# EAGLE board whiskashisei-ver4.1 (EAGLE 9.0.1), part 1 of 2
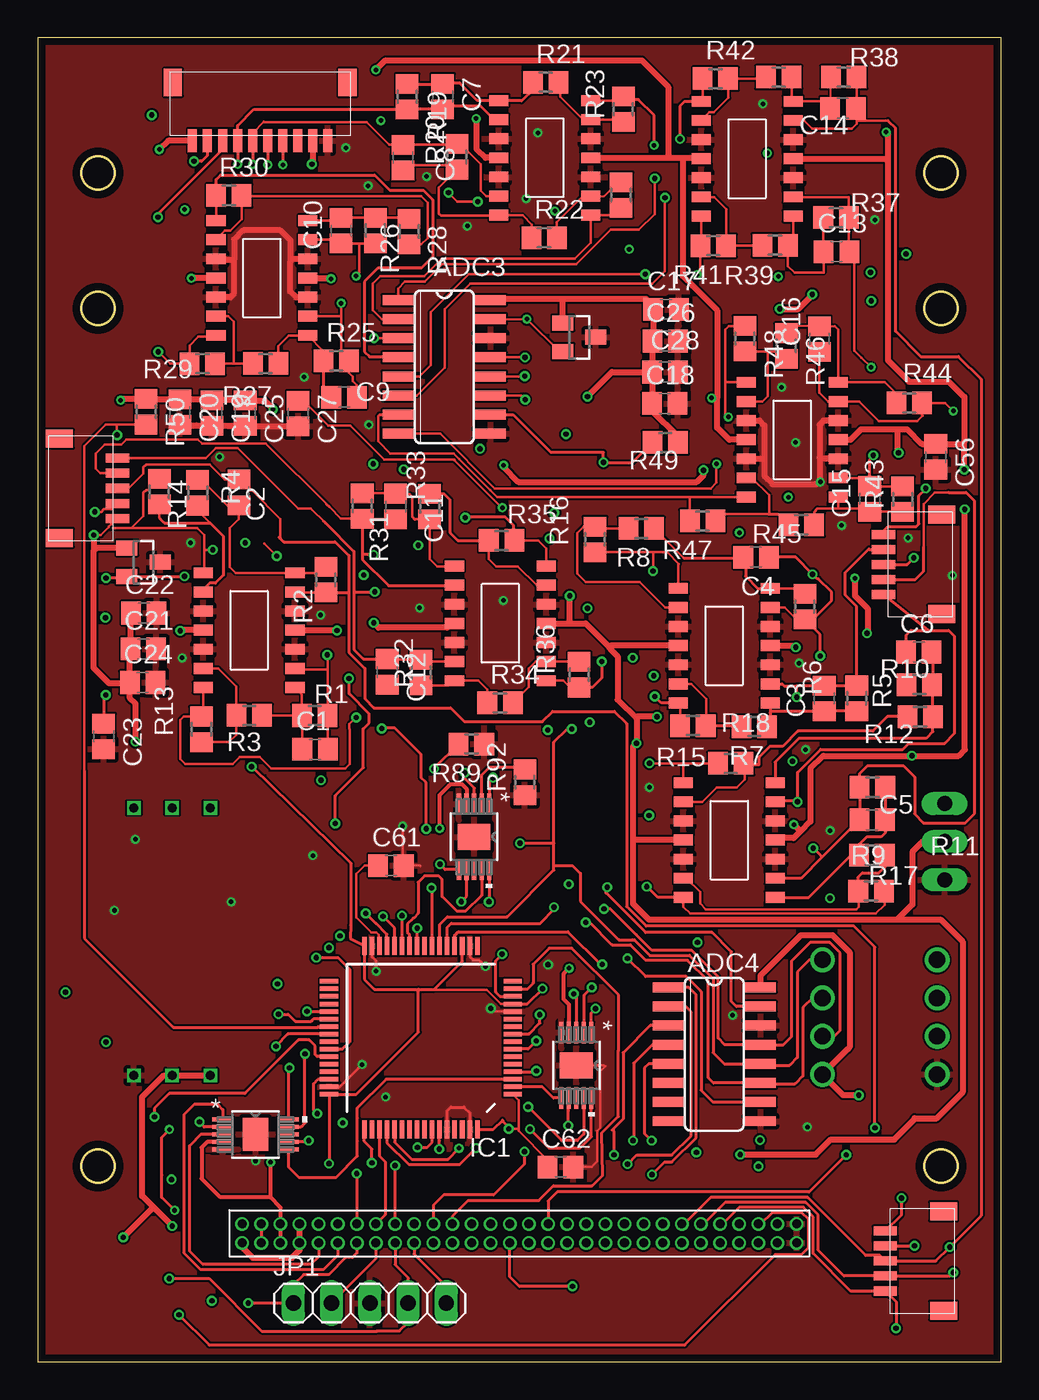
[diagram p5: board, top side]
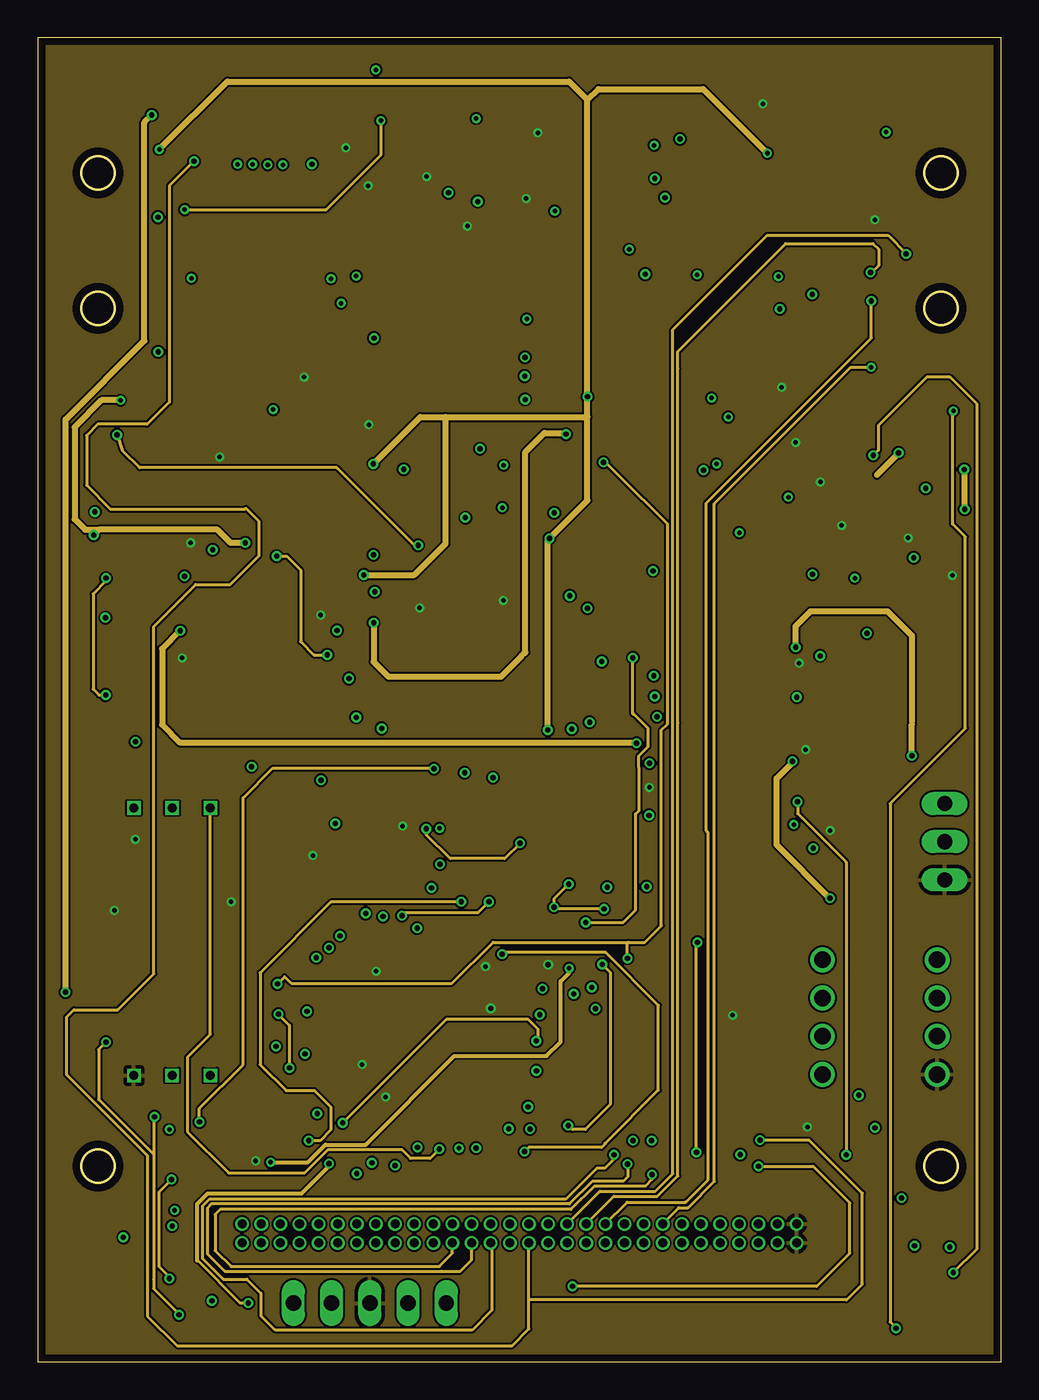
[diagram p6: board, inner layer Route2]
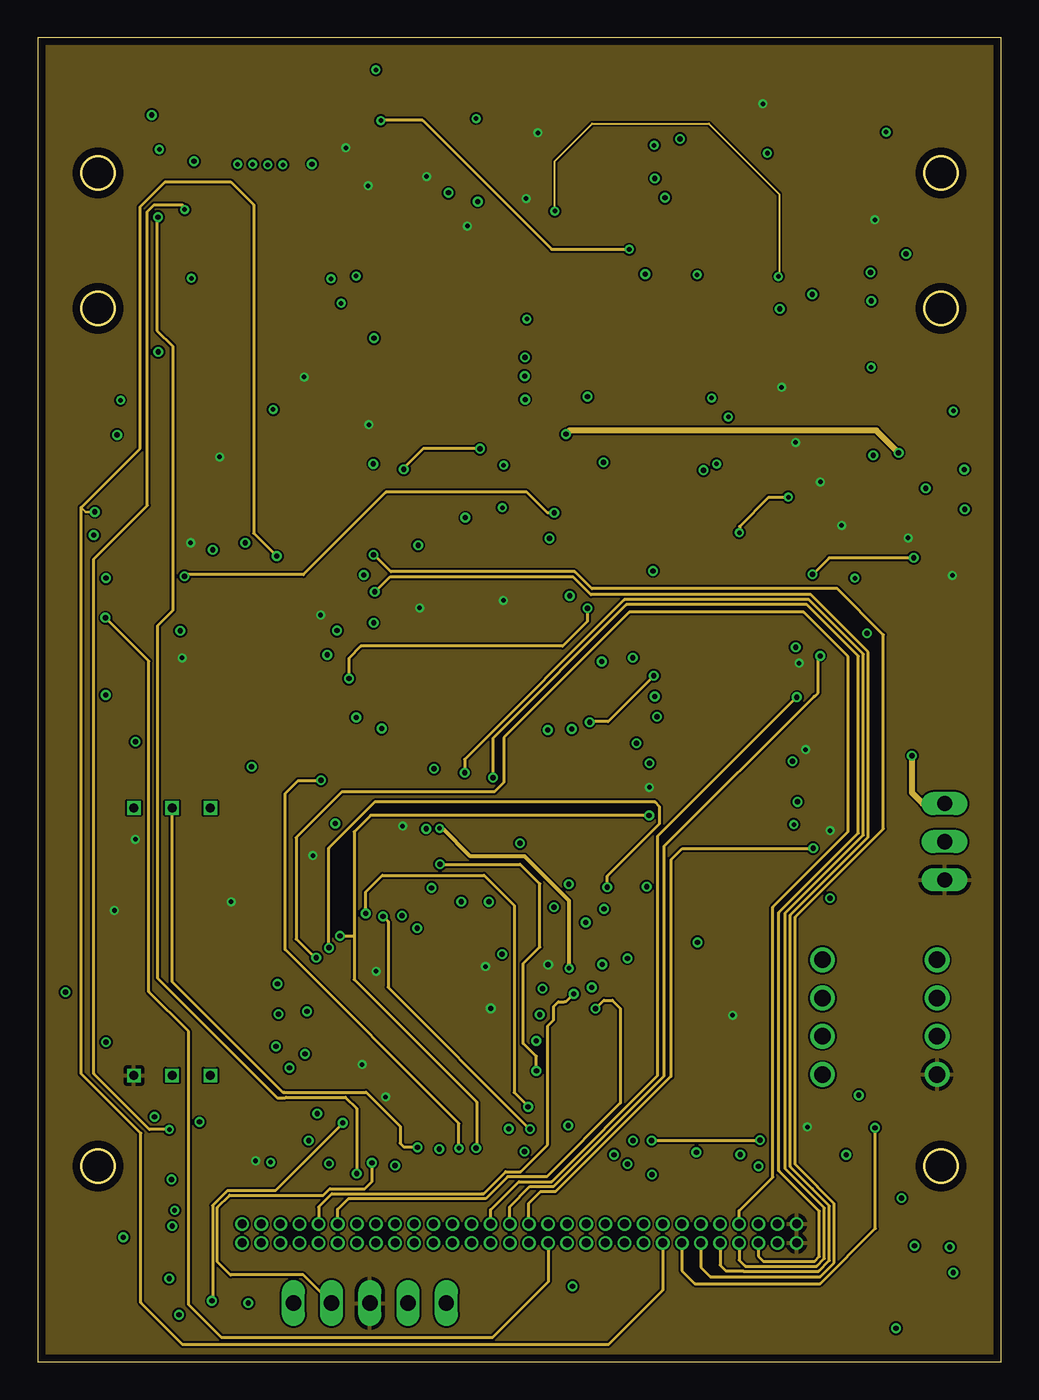
[diagram p7: board, inner layer Route15]
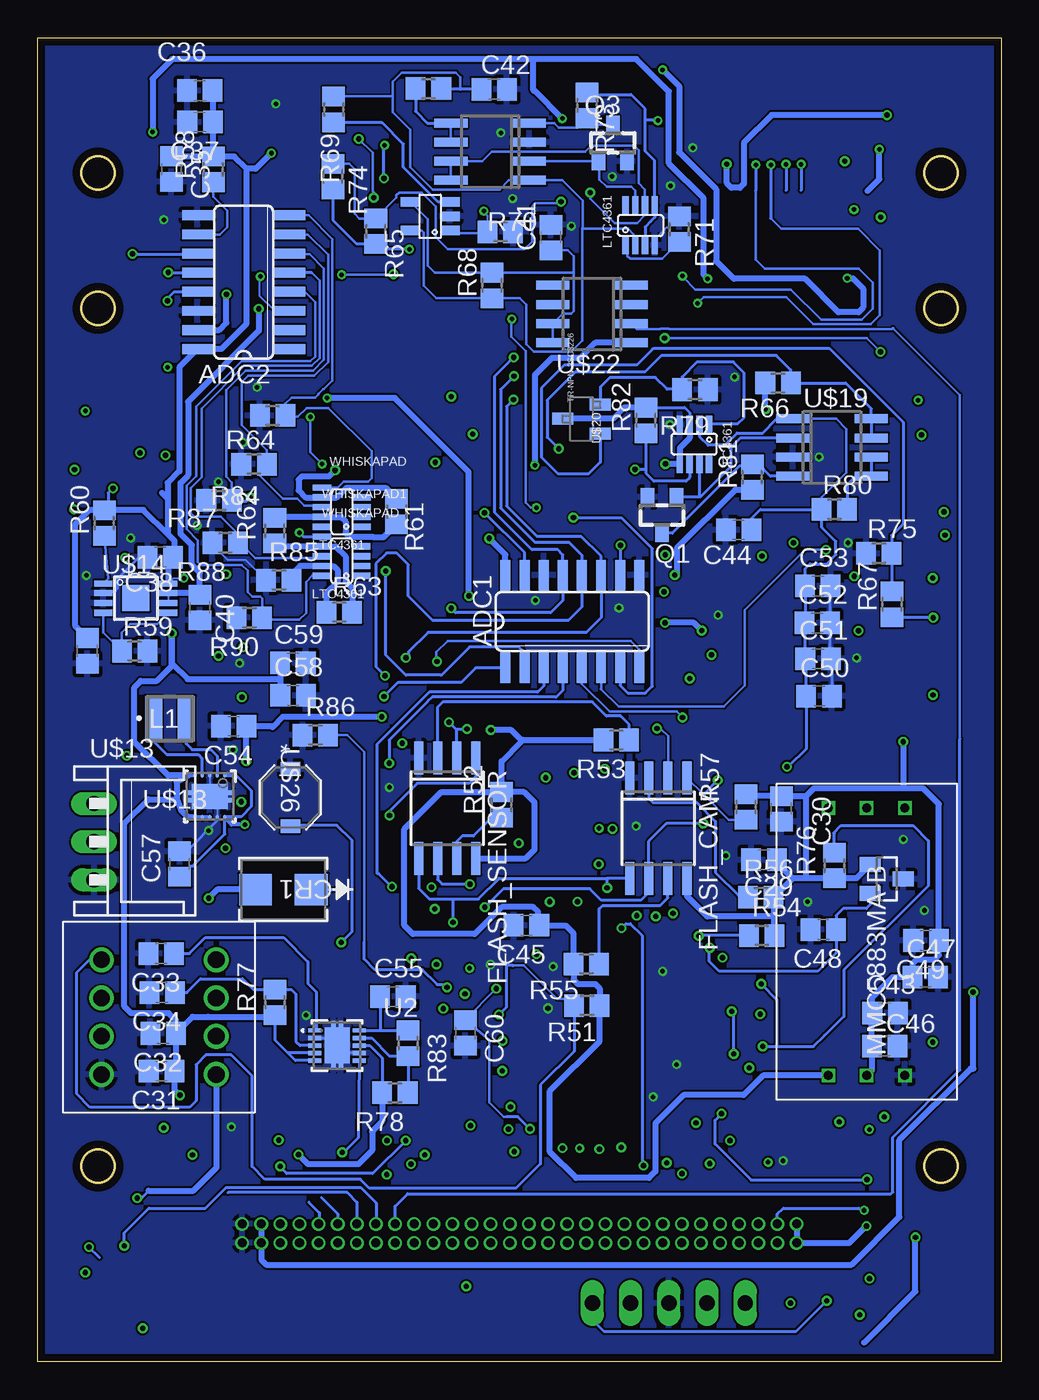
[diagram p8: board, bottom side, seen from below]

Size 64 x 88 mm. Coordinates in mm from the lower left corner, seen from the top.
Outline: 0,0 64,0 64,88 0,88 0,0
Outline: circle at 4,13 radius 1.1
Outline: circle at 60,13 radius 1.1
Outline: circle at 4,70 radius 1.1
Outline: circle at 4,79 radius 1.1
Outline: circle at 60,79 radius 1.1
Outline: circle at 60,70 radius 1.1
Copper layers (1+2*15+16): Top 0.018mm / dielectric 0.25mm / Route2 0.035mm / dielectric 1mm / Route15 0.035mm / dielectric 0.25mm / Bottom 0.018mm
Design rules "pban_5mil-l4": minimum track width 5mil, minimum drill 0.3mm, track to track 5mil, track to pad 0.229mm, pad to pad 5mil, via to via 5mil, smd to smd 5mil, copper to edge 0.5mm, drill to drill 0.5mm, minimum pad ring 0.15mm, minimum via ring 0.15mm, stop-mask expansion 4mil, vias tented up to drill 0.35mm, thermal gap 10mil
tKeepout: area 1.5,76.5 to 6.5,81.5; 4 lines

## Footprints (pad centres in the part's own frame; a part is rotated, then mirrored left to right if it is on the bottom)
SO16 = smd 0.66 x 2.032: 1 -4.445,-3.073; 2 -3.175,-3.073; 3 -1.905,-3.073; 4 -0.635,-3.073; 5 0.635,-3.073; 6 1.905,-3.073; 7 3.175,-3.073; 8 4.445,-3.073; 9 4.445,3.073; 10 3.175,3.073; 11 1.905,3.073; 12 0.635,3.073; 13 -0.635,3.073; 14 -1.905,3.073; 15 -3.175,3.073; 16 -4.445,3.073
C2012 = smd 1.3 x 1.5: 1 -0.85,0; 2 0.85,0
DIODE_DO214AA = smd 2.184 x 2.083: 1 -1.854,0; 2 1.854,0
SO-08M = smd 0.6 x 2.2: 1 -1.905,-3.33; 2 -0.635,-3.33; 3 0.635,-3.33; 4 1.905,-3.33; 5 1.905,3.33; 6 0.635,3.33; 7 -0.635,3.33; 8 -1.905,3.33
LQFP64_PACKAGE = smd 1.2 x 0.3: 1 -6.1,3.75; 2 -6.1,3.25; 3 -6.1,2.75; 4 -6.1,2.25; 5 -6.1,1.75; 6 -6.1,1.25; 7 -6.1,0.75; 8 -6.1,0.25; 9 -6.1,-0.25; 10 -6.1,-0.75; 11 -6.1,-1.25; 12 -6.1,-1.75; 13 -6.1,-2.25; 14 -6.1,-2.75; 15 -6.1,-3.25; 16 -6.1,-3.75; 33 6.1,-3.75; 34 6.1,-3.25; 35 6.1,-2.75; 36 6.1,-2.25; 37 6.1,-1.75; 38 6.1,-1.25; 39 6.1,-0.75; 40 6.1,-0.25; 41 6.1,0.25; 42 6.1,0.75; 43 6.1,1.25; 44 6.1,1.75; 45 6.1,2.25; 46 6.1,2.75; 47 6.1,3.25; 48 6.1,3.75 | smd 0.3 x 1.2: 17 -3.75,-6.1; 18 -3.25,-6.1; 19 -2.75,-6.1; 20 -2.25,-6.1; 21 -1.75,-6.1; 22 -1.25,-6.1; 23 -0.75,-6.1; 24 -0.25,-6.1; 25 0.25,-6.1; 26 0.75,-6.1; 27 1.25,-6.1; 28 1.75,-6.1; 29 2.25,-6.1; 30 2.75,-6.1; 31 3.25,-6.1; 32 3.75,-6.1; 49 3.75,6.1; 50 3.25,6.1; 51 2.75,6.1; 52 2.25,6.1; 53 1.75,6.1; 54 1.25,6.1; 55 0.75,6.1; 56 0.25,6.1; 57 -0.25,6.1; 58 -0.75,6.1; 59 -1.25,6.1; 60 -1.75,6.1; 61 -2.25,6.1; 62 -2.75,6.1; 63 -3.25,6.1; 64 -3.75,6.1
1X05 = drill 1.016 long: 1 -5.08,0; 2 -2.54,0; 3 0,0; 4 2.54,0; 5 5.08,0
LPS3015 = smd 1.14 x 3.05: 1 -1.08,0; 2 1.08,0
SOT23 = smd 0.9 x 1.2: 1 -0.95,-1.2; 2 0.95,-1.2; 3 0,1.2
R2012 = smd 1.3 x 1.5: 1 -0.85,0; 2 0.85,0
DRC0010A = smd 0.36 x 0.24: 1 -1.4,1; 2 -1.4,0.5; 3 -1.4,0; 4 -1.4,-0.5; 5 -1.4,-1; 6 1.4,-1; 7 1.4,-0.5; 8 1.4,0; 9 1.4,0.5; 10 1.4,1 | smd 1.65 x 2.4: 11 0,0 | smd 0.305 x 0.61: P$1 -0.25,1.21; P$2 0.25,1.21; P$3 -0.25,-1.21; P$4 0.25,-1.21 | smd 0.5 x 0.5: V 0,-0.95
DRC10_2P4X1P65 = smd 0.85 x 0.28: 1 -1.475,1; 2 -1.475,0.5; 3 -1.475,0; 4 -1.475,-0.5; 5 -1.475,-1; 6 1.475,-1; 7 1.475,-0.5; 8 1.475,0; 9 1.475,0.5; 10 1.475,1 | smd 1.65 x 2.4: 11 0,0 | smd 0.305 x 0.61: 12 -0.25,1.32; 13 0.25,1.32; 14 -0.25,-1.32; 15 0.25,-1.32
1.27_60 = drill 0.6: P$1 -0.635,18.415; P$2 0.635,18.415; P$3 -0.635,17.145; P$4 0.635,17.145; P$5 -0.635,15.875; P$6 0.635,15.875; P$7 -0.635,14.605; P$8 0.635,14.605; P$9 -0.635,13.335; P$10 0.635,13.335; P$11 -0.635,12.065; P$12 0.635,12.065; P$13 -0.635,10.795; P$14 0.635,10.795; P$15 -0.635,9.525; P$16 0.635,9.525; P$17 -0.635,8.255; P$18 0.635,8.255; P$19 -0.635,6.985; P$20 0.635,6.985; P$21 -0.635,5.715; P$22 0.635,5.715; P$23 -0.635,4.445; P$24 0.635,4.445; P$25 -0.635,3.175; P$26 0.635,3.175; P$27 -0.635,1.905; P$28 0.635,1.905; P$29 -0.635,0.635; P$30 0.635,0.635; P$31 -0.635,-0.635; P$32 0.635,-0.635; P$33 -0.635,-1.905; P$34 0.635,-1.905; P$35 -0.635,-3.175; P$36 0.635,-3.175; P$37 -0.635,-4.445; P$38 0.635,-4.445; P$39 -0.635,-5.715; P$40 0.635,-5.715; P$41 -0.635,-6.985; P$42 0.635,-6.985; P$43 -0.635,-8.255; P$44 0.635,-8.255; P$45 -0.635,-9.525; P$46 0.635,-9.525; P$47 -0.635,-10.795; P$48 0.635,-10.795; P$49 -0.635,-12.065; P$50 0.635,-12.065; P$51 -0.635,-13.335; P$52 0.635,-13.335; P$53 -0.635,-14.605; P$54 0.635,-14.605; P$55 -0.635,-15.875; P$56 0.635,-15.875; P$57 -0.635,-17.145; P$58 0.635,-17.145; P$59 -0.635,-18.415; P$60 0.635,-18.415
MMC5883MA-B = drill 0.6 square: 1 8.89,2.54; 2 8.89,0; 3 8.89,-2.54; 4 -8.89,2.54; 5 -8.89,0; 6 -8.89,-2.54
L3GD20_SET = drill 1.1: CS 10.16,2.54; GND 10.16,10.16; INT1 10.16,7.62; INT2 10.16,5.08; SCL 2.54,7.62; SDI 2.54,5.08; SDO 2.54,2.54; VDD 2.54,10.16
NJM064M = smd 1.27 x 0.72: 1 -3.05,3.81; 2 -3.05,2.54; 3 -3.05,1.27; 4 -3.05,0; 5 -3.05,-1.27; 6 -3.05,-2.54; 7 -3.05,-3.81; 8 3.05,-3.81; 9 3.05,-2.54; 10 3.05,-1.27; 11 3.05,0; 12 3.05,1.27; 13 3.05,2.54; 14 3.05,3.81
JST_3 = drill 1.016 long: 1 2.56,2.56; 2 5.1,2.56; 3 7.64,2.56
ADR3525 = smd 0.4 x 1.2: 1 -1.405,-1.337; 2 -0.755,-1.337; 3 -0.105,-1.337; 4 0.545,-1.337; 5 0.545,2.977; 6 -0.105,2.977; 7 -0.755,2.977; 8 -1.405,2.977 | smd 1.73 x 1.78: TH -0.43,0.82
LTC4361_2 = smd 0.42 x 1.22: P$1 0,0; P$2 0.65,0; P$3 1.3,0; P$4 1.95,0; P$5 1.95,2.62; P$6 1.3,2.62; P$7 0.65,2.62; P$8 0,2.62
SO-08 = smd 0.6 x 2.2: 1 -1.815,-2.74; 2 -0.545,-2.74; 3 0.725,-2.74; 4 1.995,-2.74; 5 1.995,2.46; 6 0.725,2.46; 7 -0.545,2.46; 8 -1.815,2.46
LT6106 = smd 0.635 x 1.27: P$1 0,-0.02; P$2 0.95,-0.02; P$3 1.9,-0.02; P$4 1.9,2.6; P$5 0,2.62
TR-NPN-2SC3326 = smd 0.8 x 1.4: B 0.5,-0.5; C 1.5,2; E 2.4,-0.5
JST_1MM_10 = smd 1.2 x 1.8: P$1 0.6,0.9; P$12 12.2,0.9 | smd 0.6 x 1.55: P$2 1.9,4.775; P$3 2.9,4.775; P$4 3.9,4.775; P$5 4.9,4.775; P$6 5.9,4.775; P$7 6.9,4.775; P$8 7.9,4.775; P$9 8.9,4.775; P$10 9.9,4.775; P$11 10.9,4.775
IND_4012 = smd 0.9 x 1.3: 1 -1.9,0; 2 1.9,0
JST_1MM_5 = smd 1.2 x 1.8: P$1 0.6,0.9; P$7 7.2,0.9 | smd 0.6 x 1.55: P$2 1.9,4.775; P$3 2.9,4.775; P$4 3.9,4.775; P$5 4.9,4.775; P$6 5.9,4.775
SOT23' = smd 1 x 1.4: 1 -0.95,-1.1; 2 0.95,-1.1; 3 0,1.1
LTC4361_2' = smd 0.42 x 1.22: P$1 0,0
DGQ10_2P18X1P72 = smd 1.411 x 0.27: 1 -2.175,1; 2 -2.175,0.5; 3 -2.175,0; 4 -2.175,-0.5; 5 -2.175,-1; 6 2.175,-1; 7 2.175,-0.5; 8 2.175,0; 9 2.175,0.5; 10 2.175,1 | smd 1.72 x 2.18: 11 0,0

## Placement (x,y rotation side)
ADC1  ADC_MCP3208  [SO16]  28.48,49.21 0 bottom
ADC2  ADC_MCP3208  [SO16]  50.32,71.75 90 bottom
ADC3  ADC_MCP3208  [SO16]  27.01,66.12 270 top
ADC4  ADC_MCP3208  [SO16]  44.95,20.44 270 top
C1  1u  [C2012]  18.43,40.7 0 top
C2  1u  [C2012]  13.37,57.78 270 top
C3  1u  [C2012]  52.25,44.09 90 top
C4  1u  [C2012]  47.72,53.47 180 top
C5  1u  [C2012]  55.44,36.02 180 top
C6  1u  [C2012]  58.54,47.17 0 top
C7  1u  [C2012]  26.9,84.08 270 top
C8  1u  [C2012]  24.27,80.03 270 top
C9  1u  [C2012]  20.36,64.11 0 top
C10  1u  [C2012]  20.16,75.17 90 top
C11  1u  [C2012]  23.79,56.85 270 top
C12  1u  [C2012]  23.23,45.86 270 top
C13  1u  [C2012]  53.07,73.77 0 top
C14  1u  [C2012]  53.5,83.31 180 top
C15  1u  [C2012]  55.27,57.35 90 top
C16  1u  [C2012]  51.94,67.97 90 top
C17  0.1u  [C2012]  41.74,69.94 0 top
C18  1u  [C2012]  41.66,63.69 0 top
C19  0.1u  [C2012]  11.57,63.05 270 top
C20  1u  [C2012]  9.45,63.11 270 top
C21  0.1u  [C2012]  7.02,47.38 0 top
C22  1u  [C2012]  7.05,49.76 0 top
C23  0.1u  [C2012]  4.39,41.56 270 top
C24  10u  [C2012]  6.98,45.14 0 top
C25  0.1u  [C2012]  13.79,63.04 270 top
C26  1u  [C2012]  41.68,67.83 0 top
C27  0.1u  [C2012]  17.3,63.02 270 top
C28  10u  [C2012]  41.67,65.77 0 top
C29  0.1u  [C2012]  15.75,33.37 180 bottom
C30  0.1u  [C2012]  14.6,36.75 270 bottom
C31  0.1u  [C2012]  55.77,19.32 180 bottom
C32  10u  [C2012]  55.66,21.83 180 bottom
C33  4700p  [C2012]  55.79,27.14 180 bottom
C34  10u  [C2012]  55.73,24.55 180 bottom
C35  [C2012]  55.11,79.27 270 bottom
C36  [C2012]  53.22,84.48 180 bottom
C37  [C2012]  53.21,82.39 180 bottom
C38  0.1u  [C2012]  55.85,53.47 180 bottom
C39  1u  [C2012]  60.7,47.25 270 bottom
C40  0.1u  [C2012]  53.22,50.13 270 bottom
C41  0.1u  [C2012]  29.9,74.71 90 bottom
C42  1u  [C2012]  33.68,84.57 0 bottom
C43  0.1u  [C2012]  7.71,23.18 0 bottom
C44  1u  [C2012]  17.44,55.29 180 bottom
C45  1u  [C2012]  31.53,29.01 180 bottom
C46  0.1u  [C2012]  7.73,20.99 0 bottom
C47  1u  [C2012]  5.03,25.57 0 bottom
C48  0.1u  [C2012]  11.81,28.73 180 bottom
C49  10u  [C2012]  4.99,28.01 180 bottom
C50  0.1u  [C2012]  12.1,44.24 0 bottom
C51  0.1u  [C2012]  12.16,46.73 0 bottom
C52  0.1u  [C2012]  12.22,49.11 0 bottom
C53  0.1u  [C2012]  12.17,51.56 0 bottom
C54  22u  [C2012]  50.97,42.24 180 bottom
C55  0.22u  [C2012]  40.4,24.27 0 bottom
C56  0.1u  [C2012]  59.66,60.15 270 top
C57  10u  [C2012]  54.58,33.09 90 bottom
C58  0.1u  [C2012]  47.03,44.29 0 bottom
C59  10u  [C2012]  47.04,46.45 0 bottom
C60  0.1u  [C2012]  35.58,21.86 270 bottom
C61  2.2u  [C2012]  23.47,32.98 0 top
C62  1u  [C2012]  34.73,12.95 0 top
CR1  SL23-E3/52T  [DIODE_DO214AA]  47.67,31.39 180 bottom
FLASH_CAM  MP25P80  [SO-08M]  22.77,35.47 180 bottom
FLASH_SENSOR  MP25P80  [SO-08M]  36.79,36.79 180 bottom
IC1  STM32F446_LQFP64  [LQFP64_PACKAGE]  25.46,21.54 180 top
JP1  [1X05]  22.07,3.9 0 top
L1  LPS3015-222MRB  [LPS3015]  55.21,42.74 0 bottom
Q1  BSS138  [SOT23]  22.52,56.28 180 bottom
Q3  BSS138  [SOT23]  25.79,81 0 bottom
R1  [R2012]  18.41,42.95 0 top
R2  [R2012]  19.14,51.98 270 top
R3  1k  [R2012]  14.05,42.96 180 top
R4  1k  [R2012]  10.63,57.76 270 top
R5  [R2012]  54.41,44.09 90 top
R6  [R2012]  50.97,50.2 270 top
R7  1k  [R2012]  47.61,42.22 180 top
R8  1k  [R2012]  40.1,55.39 180 top
R9  [R2012]  55.45,38.18 180 top
R10  [R2012]  58.57,45.01 180 top
R11  1k  [R2012]  55.42,33.67 0 top
R12  1k  [R2012]  58.62,42.87 180 top
R13  [R2012]  10.88,42.04 90 top
R14  [R2012]  8.08,57.83 270 top
R15  [R2012]  43.53,42.28 180 top
R16  [R2012]  37.02,54.66 90 top
R17  [R2012]  55.36,31.29 0 top
R18  [R2012]  46.04,39.77 0 top
R19  [R2012]  24.54,84.07 270 top
R20  [R2012]  27.85,80.07 90 top
R21  1k  [R2012]  33.76,85.03 0 top
R22  1k  [R2012]  33.64,74.7 0 top
R23  [R2012]  38.91,83.25 90 top
R24  [R2012]  38.75,77.54 90 top
R25  [R2012]  19.83,66.52 0 top
R26  [R2012]  22.44,75.18 270 top
R27  1k  [R2012]  15.14,66.35 180 top
R28  1k  [R2012]  24.68,75.11 270 top
R29  [R2012]  10.95,66.33 180 top
R30  [R2012]  12.71,77.51 0 top
R31  [R2012]  21.56,56.88 270 top
R32  [R2012]  25.47,45.81 90 top
R33  1k  [R2012]  26.04,56.84 90 top
R34  1k  [R2012]  30.72,43.8 0 top
R35  [R2012]  30.82,54.58 0 top
R36  [R2012]  35.97,45.66 90 top
R37  [R2012]  53.04,76.05 0 top
R38  [R2012]  53.55,85.38 0 top
R39  1k  [R2012]  48.99,74.2 180 top
R40  1k  [R2012]  49.23,85.38 180 top
R41  [R2012]  44.88,74.17 180 top
R42  [R2012]  45.02,85.28 0 top
R43  [R2012]  57.47,57.33 90 top
R44  [R2012]  57.9,63.72 0 top
R45  1k  [R2012]  50.73,55.63 180 top
R46  1k  [R2012]  49.74,67.51 270 top
R47  [R2012]  44.17,55.88 180 top
R48  [R2012]  46.98,67.99 270 top
R49  [R2012]  41.69,61.1 180 top
R50  [R2012]  7.2,63.14 270 top
R51  10k  [R2012]  27.52,23.68 180 bottom
R52  10k  [R2012]  33.18,37.02 90 bottom
R53  10k  [R2012]  25.56,41.33 180 bottom
R54  10k  [R2012]  15.9,28.33 0 bottom
R55  10k  [R2012]  27.55,26.44 180 bottom
R56  10k  [R2012]  15.96,30.87 0 bottom
R57  10k  [R2012]  16.94,36.88 90 bottom
R58  [R2012]  52.33,79.24 90 bottom
R59  10k  [R2012]  57.56,47.24 0 bottom
R60  10k  [R2012]  59.57,55.75 90 bottom
R61  [R2012]  40.16,56.51 270 bottom
R62  [R2012]  48.25,55.23 90 bottom
R63  [R2012]  43.97,49.82 0 bottom
R64  [R2012]  48.39,62.89 180 bottom
R65  0.10  [R2012]  41.54,75.13 270 bottom
R66  0.10  [R2012]  14.81,65.05 180 bottom
R67  1k  [R2012]  7.24,50.34 90 bottom
R68  0.1  [R2012]  33.82,71.53 90 bottom
R69  10  [R2012]  44.34,83.23 270 bottom
R70  22k  [R2012]  33.26,75.1 0 bottom
R71  10k  [R2012]  21.37,75.28 270 bottom
R72  10  [R2012]  38.04,84.61 180 bottom
R73  10k  [R2012]  27.5,83.5 270 bottom
R74  0.62  [R2012]  44.39,78.76 270 bottom
R75  10k  [R2012]  8.12,53.73 0 bottom
R76  [R2012]  11.07,32.98 90 bottom
R77  1k  [R2012]  48.23,23.89 90 bottom
R78  410k  [R2012]  40.27,17.89 180 bottom
R79  10k  [R2012]  20.33,64.61 180 bottom
R80  10  [R2012]  11.07,56.66 0 bottom
R81  10k  [R2012]  16.52,58.8 90 bottom
R82  0.62  [R2012]  23.6,62.56 90 bottom
R83  150k  [R2012]  39.39,21.18 270 bottom
R84  [R2012]  49.62,59.65 180 bottom
R85  1Ω  [R2012]  47.98,51.94 0 bottom
R86  0  [R2012]  45.55,41.65 0 bottom
R87  [R2012]  51.95,57.25 180 bottom
R88  [R2012]  51.53,54.43 180 bottom
R89  0  [R2012]  28.82,41.06 180 top
R90  [R2012]  49.93,49.45 180 bottom
R92  0  [R2012]  32.37,38.52 90 top
U1  Value  [DRC0010A]  52.56,37.58 270 bottom
U2  TPS63700DRCRG4  [DRC10_2P4X1P65]  44.11,21.02 0 bottom
U$1  1.27_60  [1.27_60]  32,8.54 90 top
U$3  [MMC5883MA-B]  8.93,27.92 270 bottom
U$4  L3GD20_SET  [L3GD20_SET]  49.59,29.26 180 bottom
U$5  NJM064M  [NJM064M]  14.05,48.62 180 top
U$6  NJM064M  [NJM064M]  45.61,47.6 180 top
U$7  NJM064M  [NJM064M]  45.95,34.68 180 top
U$8  NJM064M  [NJM064M]  33.69,80.01 0 top
U$9  NJM064M  [NJM064M]  14.9,72.03 180 top
U$10  NJM064M  [NJM064M]  30.74,49.07 0 top
U$11  NJM064M  [NJM064M]  47.13,79.95 180 top
U$12  NJM064M  [NJM064M]  50.13,61.28 180 top
U$13  JST_3  [JST_3]  62.81,39.67 270 bottom
U$14  ADR3525  [ADR3525]  58.29,50.33 270 bottom
U$15  LTC4361  [LTC4361_2]  24.95,74.22 0 bottom
U$16  IRF7910  [SO-08]  34.08,80.33 90 bottom
U$17  LTC4361  [LTC4361_2]  19.39,62.29 180 bottom
U$18  LT6106  [LT6106]  36.63,75.18 90 bottom
U$19  IRF7910  [SO-08]  11.09,60.86 270 bottom
U$20  TR-NPN-2SC3326  [TR-NPN-2SC3326]  27.12,61.2 90 bottom
U$21  JST_1MM_10  [JST_1MM_10]  21.18,85.92 180 top
U$22  IRF7910  [SO-08]  27.32,69.54 90 bottom
U$23  LTC4361  [LTC4361_2]  42.49,55.5 90 bottom
U$26  VLF4012  [IND_4012]  47.21,37.51 270 bottom
U$27  LTC4361  [LTC4361_2]  42.5,52.24 90 bottom
U$31  JST_1MM_5  [JST_1MM_5]  60.96,49.09 90 top
U$32  JST_1MM_5  [JST_1MM_5]  0.53,61.95 270 top
U$34  JST_1MM_5  [JST_1MM_5]  61.09,2.81 90 top
V_REF1  LM50  [SOT23']  7.03,53.14 270 top
V_REF2  LM50  [SOT23']  35.99,68.08 270 top
V_REF3  LM50  [SOT23']  7.59,32.09 270 bottom
WHISKAPAD1  WHISKAPAD  [LTC4361_2']  45.11,54.84 270 bottom
WHISKAPAD2  WHISKAPAD  [LTC4361_2']  45.11,58.1 270 bottom
X_DRV  DRV8832_DGQ_10  [DGQ10_2P18X1P72]  35.79,19.71 270 top
X_DRV1  DRV8832_DGQ_10  [DGQ10_2P18X1P72]  14.47,15.11 0 top
X_DRV2  DRV8832_DGQ_10  [DGQ10_2P18X1P72]  28.99,34.89 270 top

## Tracks (layer width: path | path; a pad name or v marks a point on that pad's centre or on a via)
2.5REF  (via drill 0.35)
  Top 0.406: v51.45,70.94 51.45,70.89 50.54,69.97 v49.3,69.97
  Bottom 0.127: U$14.7 U$14.6
  Bottom 0.406: U$14.7 53.31,51.08 C40.1 53.22,52.44 53.75,52.98 53.75,54.27 54.51,55.02 54.51,58.4 54.01,58.9 54.01,63.81 49.3,68.51 v49.3,69.97 | v51.45,70.94 51.45,69.06 51.94,68.57 ADC2.15
3V3_TOLUCA  (via drill 0.3)
  Top 0.254: U$1.P$5 U$1.P$6 16.12,10.27 15.47,10.92 | X_DRV1.4 11.25,14.61 10.89,14.25 10.89,12.18 12.09,10.98 15.41,10.98 15.47,10.92 | 15.47,10.92 v15.47,13.27 | v35.31,26.16 34.93,25.78 34.93,24.11 35.29,23.75 X_DRV.4 | v26.7,35.45 26.7,37.66 27.43,38.39 28.18,38.39 28.49,38.08 X_DRV2.4
  Route2 0.254: v15.47,13.27 17.96,13.27 19.12,14.43 21.79,14.43 27.68,20.32 33.79,20.32 34.75,21.28 34.75,25.3 35.31,25.86 v35.31,26.16
  Route15 0.254: v35.31,26.16 35.31,30.64 32.35,33.6 28.75,33.6 26.9,35.45 v26.7,35.45
3V3_WHISKA  (via drill 0.3)
  Top 0.203: U$1.P$4 U$1.P$3 | v9.1,10.07 8.24,10.93 8.24,12.39 8.26,12.41 8.26,14.93 8.75,15.42 v8.75,15.44
  Route2 0.203: v9.77,76.57 19.17,76.57 22.81,80.21 22.81,82.46 v22.8,82.47 v22.8,82.48
  Route15 0.127: v22.8,82.48 22.82,82.5
  Route15 0.203: v8.75,15.44 7.43,15.44 3.73,19.14 3.73,53.35 7.29,56.91 7.29,76.45 7.74,76.89 9.57,76.89 9.56,76.89 9.77,76.68 v9.77,76.57 | v39.3,73.93 34.15,73.93 25.58,82.5 22.82,82.5
  Bottom 0.127: 41.19,73.93 R65.2
  Bottom 0.203: U$15.P$5 23,76.06 23.27,75.8 23.65,75.41 U$15.P$3 | 23.01,76.85 23.01,79.83 23.64,80.45 23.64,82.5 | 27.37,84.21 24.57,84.21 23.64,83.27 23.64,82.5 | R65.2 42.79,74.28 44.39,75.87 R74.2 | U$1.P$4 14.86,9.82 14.46,10.22 9.45,10.22 9.3,10.07 v9.1,10.07 | v22.8,82.48 22.82,82.5 23.64,82.5 | v39.3,73.93 41.19,73.93
  Bottom 0.406: U$15.P$3 | U$15.P$5 23.01,76.85 | R73.1 27.37,84.21
+3V3  (via drill 0.3, 0.35)
  Top 0.152: v3.73,54.94 4.2,54.94 4.73,55.47 4.73,55.51 4.89,55.68 4.93,55.68 U$32.P$6
  Top 0.2: ADC4.16 48.02,25.08 | v59,58.05 59,58.01 58.54,57.55 58.54,55.69 58.35,55.5 56.49,55.5 56.19,55.2 U$31.P$6 | U$34.P$6 57.39,9.79 v57.39,10.88 | 53.94,20.9 53.83,20.79
  Top 0.406: 34.99,70.65 30.28,70.65 30.2,70.57 ADC3.16 | 34.99,70.65 40.41,70.65 40.89,70.16 C17.1 40.89,67.89 C26.1 40.83,65.78 C28.1 | V_REF2.1 34.89,70.55 34.99,70.65 | v5.51,63.9 5.59,63.99 R50.1 9.43,63.99 C20.1 11.52,63.96 C19.1 13.63,63.91 13.64,63.89 C25.1 15.08,63.89 15.65,63.32 v15.65,63.29 | v55.09,48.42 55.14,48.47 55.14,50.07 54.29,50.92 v54.29,52.09 | U$21.P$11 8.66,81.14 v8.09,80.57 | 13.81,54.44 13.81,54.42 v13.79,54.42 | v3.73,54.94 3.73,53.91 | U$3.3 U$3.2 8.38,19.03 6.95,17.6 6.95,11.02 7.67,10.3 | 53.94,20.9 53.94,27.22 52.81,28.35 50.7,28.35 48.02,25.67 48.02,25.08 | 53.83,20.79 U$4.VDD 53.51,17.72 v54.55,17.72 | v8.94,9.03 7.67,10.3 | v5.69,8.28 7.67,10.26 7.67,10.3 | v6.5,41.21 6.5,43.74 6.13,44.11 6.13,45.11 | 6.13,45.11 C24.1 6.13,47.33 C21.1 6.17,49.73 C22.1 | 3.73,53.91 3.71,53.88 3.71,46.14 4.74,45.11 6.13,45.11 | C28.1 40.83,63.7 C18.1 40.81,63.22 42.54,61.49 R49.1 | v36.52,64.14 38.15,65.77 C28.1 | V_REF1.1 3.91,54.09 3.73,53.91 | U$1.P$8 U$1.P$7 17.39,7.41 16.89,6.9 14.3,6.9 13.59,7.62 U$1.P$1
  Route2 0.406: v13.79,54.42 12.82,54.42 11.94,55.3 4.06,55.3 | 4.06,55.3 3.73,54.97 v3.73,54.94 | 4.06,55.3 3.15,55.3 2.45,56 2.45,62.12 4.23,63.9 v5.51,63.9 | 36.52,62.8 36.52,57.24 v34,54.72 33.89,54.61 v33.89,41.99 | 36.52,62.8 v36.52,64.14 36.52,83.84 | v22.3,59.67 25.43,62.8 27.11,62.8 | 27.11,62.8 36.52,62.8 | v21.67,52.29 25.03,52.29 27.11,54.37 27.11,62.8 | 36.52,83.84 36.52,83.87 35.31,85.08 12.6,85.08 v8.09,80.57 | 36.52,83.84 37.26,84.58 44.21,84.58 v48.47,80.32 v48.48,80.32
  Bottom 0.127: U$14.8 54.96,52.09 v54.29,52.09
  Bottom 0.2: 20.86,30.95 FLASH_CAM.8 | U$17.P$3 20.69,63.09 21.02,63.41 R82.2 | v22.3,59.67 | R77.1 48.23,22.58 | 48.14,23.13 R77.1 | 54.81,37.38 54.76,37.39 | 47.38,20.52 46.88,20.02 U2.5 | R77.1 48.23,21.37 47.38,20.52 | U2.4 47.38,20.52 | 54.86,53.47 C38.1 | v59,58.05 59.31,57.74 59.31,56.85 59.56,56.61 R60.2 | v57.39,10.88 57.12,10.88 56.63,11.38
  Bottom 0.203: U1.7 U1.8
  Bottom 0.254: U1.8 U1.6 | U1.5 54.02,38.96
  Bottom 0.406: ADC1.16 32.92,53.65 v34,54.72 | U$14.8 55.32,53.16 C38.1 54.92,53.55 54.92,54.56 55.37,55.02 | C39.1 61.53,48.93 61.53,55.63 60.57,56.6 R60.2 | C36.1 52.37,82.4 C37.1 52.36,80.12 R58.2 | R58.2 55.08,80.09 C35.1 | R58.2 50.92,80.09 50.11,79.28 | 50.11,79.28 50.11,69 51.79,67.33 52.16,67.33 52.19,67.3 ADC2.16 54.59,66.1 54.59,59.18 55.37,58.4 55.37,57.38 | v8.09,80.57 8.09,78.6 8.87,77.82 | 8.58,23.16 C46.1 8.58,19.38 U$3.2 | 8.58,23.16 C43.1 | U$1.P$2 U$1.P$1 10.09,7.9 8.96,9.03 v8.94,9.03 | R57.2 16.82,37.6 C30.1 13.01,37.6 12.98,37.57 | 12.98,32.13 R76.1 9.61,32.13 V_REF3.1 | 12.98,37.57 12.98,32.13 | 8.58,23.16 8.58,24.19 7.2,25.57 C47.1 5.88,26.49 5.62,26.75 4.42,26.75 4.14,27.04 C49.1 4.14,37.07 5.18,38.12 6.56,38.12 | 15.11,29.61 R56.2 13.85,32.13 | 15.11,29.61 15.11,28.39 R54.2 | 20.86,30.95 19.51,29.59 15.13,29.59 15.11,29.61 | R51.1 26.66,24.82 26.95,25.11 28.11,25.11 28.4,25.39 R55.2 28.4,28.47 28.92,29 30.66,29 C45.1 30.76,29.09 30.76,29.93 31.06,30.23 33.17,30.23 34.97,28.43 39.08,28.43 39.64,28.99 39.64,35.41 37.17,37.87 R52.2 | R51.1 | R53.2 31.77,41.33 31.88,41.21 | R52.2 33.18,39.91 31.88,41.21 | U$3.3 15.8,19.03 17.1,17.73 21.09,17.73 22.96,15.86 22.96,12.65 23.39,12.23 28.24,12.23 29.96,13.96 29.96,18 26.66,21.3 R51.1 | 12.98,37.57 12.43,38.12 6.56,38.12 | v6.5,41.21 6.5,38.17 6.56,38.12 | v5.69,8.28 5.69,4.68 9.09,1.28 | FLASH_SENSOR.8 31.58,33.46 30.99,34.05 30.99,37.18 31.68,37.87 R52.2 | U$20.C 25.74,62.7 25.02,63.41 R82.2 | 55.37,57.38 55.37,55.02 | 55.37,55.02 55.37,55.01 56.97,56.61 59.56,56.61 | U$17.P$3 20.69,61.38 21.34,60.73 U$17.P$5 v22.3,59.67
  Bottom 0.406: 31.88,41.21 31.88,41.34 32.53,41.99 v33.89,41.99 | R81.1 17.67,57.95 21.54,54.07 21.54,52.41 v21.66,52.29 v21.67,52.29 | 56.63,11.38 53.65,11.38 52.13,12.9 U$4.VDD | v15.65,63.29 15.66,63.29 R66.2 | 12.98,32.13 13.85,32.13 | 13.85,32.13 14.9,33.18 C29.1 | v48.48,80.32 49.52,79.28 50.11,79.28 | C59.1 47.89,45.37 | 47.89,45.37 C58.1 | C32.1 54.81,19.43 C31.1 54.92,18.09 v54.55,17.72 | C32.1 53.7,22.94 52.68,22.94 52.65,22.92 48.35,22.92 48.14,23.13 | C32.1 54.81,22.69 55.28,23.17 57.79,23.17 58.23,23.61 58.23,35.77 56.62,37.38 54.81,37.38 | U1.6 53.99,36.16 54.47,36.65 54.76,37.39 54.76,38.53 54.02,38.96 55.33,38.96 57.58,41.21 57.58,44.83 57.16,45.25 56.08,45.25 55.09,46.24 v55.09,48.42 55.09,46.42 54.04,45.37 47.89,45.37 | 55.73,57.74 55.37,57.38
+X_IN  (via drill 0.35)
  Top 0.2: v40.81,12.45 41.64,13.28 42.13,13.28 43.75,14.89 43.75,24.39 43.25,24.89 ADC4.1
  Route2 0.2: U$1.P$23 27.55,7.22 26.68,6.35 12.85,6.35 11.8,7.39 11.8,9.8 12.12,10.12 35.42,10.12 36.98,11.68 40.37,11.68 40.81,12.12 v40.81,12.45
+X_X1  (via drill 0.35)
  Top 0.127: 50.48,37.29 v50.48,37.22
  Top 0.2: U$1.P$34 33.91,10.69 34.51,11.29 51.25,11.29 v53.71,13.76 | R10.2 57.72,47.14 C6.1 57.69,48.29 58.01,48.62 59.1,48.62 | U$7.6 49.07,37.29 50.48,37.29 | 59.1,48.62 60.51,48.62 60.9,48.23 60.9,41.77 60.24,41.11 57.87,41.11 57.47,40.71 52.02,40.71 50.48,39.17 v50.48,37.22 | 59.1,48.62 59.14,48.65 U$31.P$2
  Route2 0.2: v50.48,37.22 50.48,36.44 53.71,33.21 v53.71,13.76
+X_X2  (via drill 0.35)
  Top 0.15: R6.2 51.04,49.28 51.03,49.28 50.49,49.28 49.63,50.14 U$6.6
  Top 0.152: U$31.P$4 55.79,52.99 55.62,52.82
  Top 0.2: U$31.P$4 57.76,52.99 v58.2,53.43 | C4.1 50.34,53.47 v51.48,52.34 51.79,52.02 51.86,52.02 52.74,51.14 52.74,50.6 51.49,49.35 R6.2 | v51.98,46.91 51.98,48.33 51.03,49.28
  Route15 0.2: U$1.P$30 31.36,10.31 32.7,11.65 34.28,11.65 41.6,18.97 41.6,34.24 51.58,44.22 51.62,44.22 51.85,44.45 51.85,46.91 v51.98,46.91 | v58.2,53.43 52.58,53.43 v51.48,52.34
+X_Y1  (via drill 0.35)
  Top 0.152: 60.51,57.77 59.61,57.77 58.86,57.02 58.86,54.16
  Top 0.2: 52.05,33.48 C5.2 54.6,36.03 R9.2 54.6,39.1 55.13,39.62 57.5,39.62 58.25,38.87 58.25,36.41 58.84,35.82 61.62,35.82 62.25,36.45 62.25,57.2 61.68,57.77 60.51,57.77 | 52.05,33.48 50.71,32.14 U$7.2 | v51.52,34.14 52.05,33.61 52.05,33.48 | U$31.P$3 58.31,51.99 58.86,52.54 58.86,54.16
  Route15 0.2: v51.52,34.14 51.52,34.1 42.82,34.1 42.06,33.34 42.06,18.97 34.41,11.32 33.42,11.32 32.63,10.54 U$1.P$32
+X_Y2  (via drill 0.35)
  Top 0.2: U$6.2 49.46,45.06 49.59,44.93 50.41,44.93 | 50.41,44.93 50.53,44.93 50.54,44.94 C3.2 54.4,44.94 R5.2 54.41,50.19 53.66,50.94 53.66,52.47 55.22,54.02 55.25,53.99 U$31.P$5 | v50.43,44.17 50.43,44.91 50.41,44.93
  Route15 0.2: U$1.P$28 30.09,10.11 31.96,11.98 34.14,11.98 41.19,19.03 41.19,34.93 v50.43,44.17
+Z_IN  (via drill 0.35)
  Top 0.2: U$21.P$10 11.28,80.16 10.9,79.77 v10.38,79.77 v10.38,79.78 | v40.79,14.71 40.31,15.18 40.31,19.52 40.6,19.81 ADC4.5
  Route2 0.2: 32.63,4.12 32.63,2.19 31.52,1.07 9.26,1.07 7.3,3.03 7.3,13.71 1.91,19.1 1.91,22.9 2.4,23.39 5.32,23.39 7.72,25.8 7.72,48.88 10.5,51.66 12.8,51.66 14.68,53.54 14.68,55.88 13.84,56.72 13.79,56.68 4.82,56.68 3.25,58.25 3.25,61.56 3.98,62.3 7.28,62.3 8.76,63.78 8.76,78.15 v10.38,79.78 | 32.63,4.12 U$1.P$31 | 32.63,4.12 53.75,4.12 54.78,5.16 54.78,11.21 51.25,14.73 v47.99,14.73
  Route15 0.2: v40.79,14.71 47.96,14.71 v47.99,14.73
+Z_X1  (via drill 0.3)
  Top 0.15: v21.16,72.15 21.38,72.37 21.38,74.32
  Top 0.152: U$9.6 19.92,74.57 C10.1 21.38,74.32 R26.2
  Top 0.2: U$21.P$5 16.28,79.56 v16.29,79.55
  Bottom 0.15: 16.3,77.81 16.3,73.25 15.69,72.64 9.47,72.64 8.54,71.71 8.54,69.98 9.25,69.27 11.96,69.27 13.96,71.27 20.32,71.27 21.16,72.11 v21.16,72.15
  Bottom 0.2: v16.29,79.55 16.29,77.83 16.3,77.82 16.3,77.81
+Z_X2  (via drill 0.3)
  Top 0.15: R20.2 27.8,80.88 C8.1 23.37,80.88 21.86,82.39 15.04,82.39 15.03,82.4
  Top 0.152: U$21.P$7 14.31,81.12 14.31,81.68 15.03,82.4 | U$8.6 29.79,77.47 29.42,77.84 29.42,79.59 28.13,80.88 27.88,80.88
  Top 0.2: U$21.P$7 v14.28,79.59 v14.29,79.58 | 27.88,80.88 R20.2
  Bottom 0.2: v14.29,79.58 14.29,77.84
+Z_Y1  (via drill 0.3)
  Top 0.15: v20.15,70.35 20.15,69.53 | 20.15,69.53 20.15,66.26 20.68,65.73 20.94,65.47 | U$9.2 20.11,69.49 20.15,69.53
  Top 0.152: R25.2 20.68,65.73 | 20.94,65.47 20.94,65.18 21.21,64.92 C9.2
  Top 0.2: U$21.P$6 v15.28,79.55 v15.29,79.55
  Bottom 0.15: 15.31,75.99 14.61,75.29 9.5,75.29 8.05,73.84 8.05,69.58 8.67,68.95 12.46,68.95 14.26,70.75 19.75,70.75 v20.15,70.35
  Bottom 0.2: 15.31,75.99 15.29,76.01 v15.29,79.55
+Z_Y2  (via drill 0.3)
  Top 0.2: v13.28,79.58 U$21.P$8 13.28,82.15 14.37,83.23 24.56,83.23 | 24.56,83.23 C7.2 27.1,83.43 29.44,83.43 30.32,82.55 U$8.2 | 24.56,83.23 R19.2
  Bottom 0.2: v13.28,79.58 13.28,77.85
-X_IN  (via drill 0.35)
  Top 0.2: ADC4.2 41.9,23.64 43.01,23.64 43.41,23.25 43.41,15.03 42.14,13.76 39.81,13.76 v39.19,13.14
  Route2 0.2: U$1.P$25 28.82,6.77 28.08,6.03 26.83,6.03 26.82,6.02 12.43,6.02 11.27,7.18 11.27,10.22 11.55,10.49 35.33,10.49 36.84,12.01 38.9,12.01 39.19,12.29 v39.19,13.14
-X_X1  (via drill 0.35)
  Top 0.15: U$10.6 25.6,46.53 R32.2 23.41,46.66 23.36,46.71 23.31,46.71 C12.1
  Top 0.152: 19.13,55.74 18.15,56.72 17.31,56.72 13.29,60.73 11.84,60.73 11.15,60.05 U$32.P$2
  Top 0.2: 23.31,46.71 21.64,46.71 21.01,47.34 21.01,51.16 21.01,53.86 19.13,55.74 19,55.87
  Top 0.203: 21.01,51.16 22.38,51.16 v22.39,51.17
  Route15 0.2: U$1.P$51 45.34,6.42 45.72,6.04 46.86,6.04 46.87,6.03 51.88,6.03 52.59,6.73 52.59,10.37 51.48,11.47 51.48,11.5 51.46,11.5 50,12.96 50,29.7 55.17,34.87 55.17,47.17 51.37,50.98 36.75,50.98 35.54,52.19 23.43,52.19 22.41,51.16 v22.4,51.16 v22.39,51.17
-X_X2  (via drill 0.35)
  Top 0.15: U$5.6 17.13,51.13 R2.2
  Top 0.152: 16.12,54.72 16.12,56.02 14.25,57.89 14.12,57.89 C2.1 12.44,58.63 11.44,59.63 7.21,59.63 7.03,59.45 7.03,59.04 6,58.01 5.35,58.01 U$32.P$4
  Top 0.2: 16.05,54.8 16.12,54.72 16.36,54.48 19.72,54.48 19.75,54.51 20.67,53.59 20.67,51.12 | 20.67,51.12 20.67,47.14 21.73,46.08 21.73,44.07 22.33,43.47 27.44,43.47 28.35,42.55 28.35,42.54 33.52,42.54 34.21,43.23 38.31,43.23 39.13,42.42 39.13,30.26 40.43,28.96 54.23,28.96 55.62,27.56 v55.62,15.56 | R2.2 20.66,51.13 20.67,51.12
  Route15 0.2: U$1.P$47 42.8,6.06 43.66,5.2 51.98,5.2 55.65,8.87 55.65,15.53 v55.62,15.56
-X_Y1  (via drill 0.35)
  Top 0.15: C11.2 21.59,56 R31.2 20.15,56.03 19.39,56.79 19.18,57
  Top 0.152: U$32.P$3 4.16,59.05 3.86,59.35 3.86,60.35 4.47,60.97 5.54,60.97 5.88,61.3 10.65,61.3 10.93,61.02 13.3,61.02 13.41,61.02 15.16,61.02 19.39,56.79
  Top 0.2: R31.2 21.56,53.65 | 21.56,53.65 21.56,53.33 23.31,51.58 27.66,51.58 U$10.2 | v22.31,53.63 22.29,53.65 21.56,53.65
  Route15 0.2: U$1.P$49 44.06,6.3 44.69,5.67 51.98,5.67 52.91,6.6 52.91,10.51 51.81,11.61 51.81,11.64 50.33,13.12 50.33,29.56 56.19,35.42 56.19,48.31 53.12,51.38 36.81,51.38 35.68,52.51 23.46,52.51 22.32,53.65 v22.31,53.63
-X_Y2  (via drill 0.35)
  Top 0.15: C1.2 19.26,40.72 R1.2 19.26,46.02 | 19.26,46.02 19.26,46.96 v19.24,46.98 | 15.05,54.38 v15.88,53.54 | U$5.2 17.16,46.02 19.26,46.02
  Top 0.152: U$32.P$5 4.91,56.66 4.41,56.66 4.23,56.48 v3.8,56.48
  Route2 0.2: v15.88,53.54 16.55,53.54 17.47,52.62 17.47,47.86 18.35,46.98 v19.24,46.98
  Route15 0.152: v3.8,56.48 3.2,56.48 2.89,56.78
  Route15 0.2: v15.88,53.54 14.36,55.07 14.36,76.89 12.82,78.42 8.47,78.42 6.81,76.76 6.81,60.7 2.89,56.78 2.89,19.16 6.85,15.2 6.85,3.94 9.64,1.15 37.91,1.15 41.52,4.76 U$1.P$45
-Y_IN  (via drill 0.35)
  Top 0.152: v38.28,13.76 38.28,15.53
  Top 0.2: ADC4.3 40.7,22.35 38.9,20.55 38.9,16.15 38.28,15.53 38.17,15.42 38.28,15.31 v38.28,13.76
  Route2 0.2: U$1.P$27 30.16,7.83 30.16,3.41 28.86,2.11 15.79,2.11 14.83,3.07 14.83,4.56 13.9,5.49 12.34,5.49 10.95,6.88 10.95,10.35 11.42,10.83 35.11,10.83 37.16,12.88 37.7,12.88 38.28,13.46 v38.28,13.76
-Y_X1  (via drill 0.3, 0.35)
  Top 0.15: v60.83,63.19 60.3,63.72 R44.2 58.75,62.93 58.78,62.9 58.42,62.53 55.87,62.53 54.58,63.82 U$12.6 52.51,63.82 51.94,64.39 C16.1
  Top 0.2: U$1.P$52 45.5,9.17 46.61,10.28 50.87,10.28 51.52,9.63 51.52,7.2 54.01,4.71 U$34.P$2 57.02,4 v57.02,2.24
  Route2 0.2: v60.83,63.19 60.9,63.12 60.79,63 60.79,55.66 61.62,54.83 61.62,42.09 56.64,37.11 56.64,2.65 57.04,2.25 v57.02,2.24
  Bottom 0.2: U$1.P$52 45.29,9.22 45.29,9.92 45.97,10.61
-Y_X2  (via drill 0.35)
  Top 0.152: R38.2 54.4,83.36 | 54.4,83.36 C14.1 | U$11.6 50.92,82.49 51.46,81.96 54.09,81.96 54.4,82.27 54.4,82.48 | 54.4,82.48 54.4,83.36 | 54.4,82.48 54.41,82.49 56.49,82.49
  Top 0.2: 56.49,82.49 56.99,81.99 56.99,68.48 58.66,66.82 61.16,66.82 62.68,65.3 62.68,9.71 v60.59,7.62 59.68,6.71 U$34.P$4 55.94,7.08 55,7.08 51.14,10.93 44.72,10.93 42.96,9.17 U$1.P$48
  Bottom 0.2: U$1.P$48 42.8,10.61 43.45,11.26 51.35,11.26 | 59.91,6.94 v60.59,7.62
-Y_Y1  (via drill 0.35)
  Top 0.15: U$12.2 54.73,58.74 C15.2 | 55.38,58.18 R43.2
  Top 0.2: 55.38,58.18 55.3,58.18 C15.2 55.27,59.95 55.51,60.18 v55.51,60.23 | U$1.P$50 44.23,9.17 45.67,10.6 51.01,10.6 51.85,9.76 51.85,7.42 53.56,5.71 U$34.P$3 60.6,5.71 v60.83,5.94
  Route2 0.2: v55.51,60.23 55.86,60.58 55.86,62.23 59.05,65.43 60.61,65.43 62.41,63.63 62.41,7.51 v60.83,5.94
  Bottom 0.2: U$1.P$50 44.06,9.84 45.15,10.93
-Y_Y2  (via drill 0.3, 0.35)
  Top 0.15: U$11.2 53.89,77.41 R37.2 53.89,73.8 C13.2 54.26,74.11 54.26,67.2 54.71,66.75 54.71,66.74 v55.36,66.09
  Top 0.2: U$34.P$5 v58.25,7.71
  Route2 0.2: v55.36,66.09 54.01,66.09 44.96,57.03 44.96,11.99 43.22,10.25 42.59,10.25 41.52,9.19 U$1.P$46
  Bottom 0.2: U$1.P$46 41.52,10.56 42.55,11.59 51.48,11.59 52.85,10.22 56.6,10.22 58.25,8.57 v58.25,7.71
-Z_IN  (via drill 0.35)
  Top 0.2: v35.53,5.02 32,5.02 31.35,5.67 31.35,7.89 U$1.P$29 | v39.55,14.7 39.59,14.7 39.59,19.84 40.83,21.08 ADC4.4
  Route2 0.2: v35.53,5.02 51.74,5.02 53.95,7.23 53.95,10.56 51.51,13 v47.89,13
  Bottom 0.2: v47.89,13 47.89,12.95 47.45,12.52 41.74,12.52 v39.55,14.7
ADC1_CS  (via drill 0.35)
  Top 0.15: 3.1,60.85 3.1,39.27 | v5.28,61.59 5.26,62.25 5.29,62.29
  Top 0.152: R50.2 5.29,62.29 4.54,62.29 3.1,60.85
  Top 0.2: IC1.39 19.34,22.27 18.62,22.27 18.6,22.24 9.01,22.24 3.1,28.16 3.1,39.27
  Route2 0.2: v5.28,61.59 5.63,60.57 6.78,59.42 19.87,59.42 25.04,54.26 v25.28,54.26
  Bottom 0.2: ADC1.10 25.28,52.31 v25.28,54.26
ADC2_CS  (via drill 0.35)
  Top 0.2: v15.84,20.96 15.82,20.98 16.63,21.79 IC1.40 | ADC4.10 44.86,17.27 44.08,18.05 44.08,24.61 43.09,25.6 40.39,25.6 39.18,26.8 v39.18,26.82 | ADC3.10 31.58,62.95 34.09,60.44 37.58,60.44 37.58,59.78 v37.59,59.77 39.51,59.77 R49.2
  Route2 0.152: 38.61,58.89 38.56,58.94
  Route2 0.2: v15.94,25.12 v15.95,25.12 16.41,25.59 16.85,25.15 27.51,25.15 30.25,27.89 39.24,27.89 | 38.56,58.94 37.73,59.77 v37.59,59.77 | 39.24,27.89 40.34,27.89 41.44,28.98 41.44,41.99 41.84,42.4 41.84,55.66 38.61,58.89 | v39.18,26.82 39.18,27.83 39.24,27.89
  Bottom 0.2: R76.2 11.07,35.09 11.13,35.15 10.63,35.64 5.85,35.64 4.84,34.63 4.84,31.64 10.45,26.03 10.45,22.95 11.7,21.7 11.72,21.7 12.46,20.96 14.89,20.96 | v15.84,20.96 14.89,20.96 | v15.94,25.12 14.89,24.07 14.89,20.96
CRT-18F  (via drill 0.3)
  Route15 0.127: v34.36,76.47 34.36,79.8 36.84,82.28 44.59,82.28 49.26,77.61 49.26,72.13 v49.21,72.13
  Bottom 0.127: R70.1 34.11,76.09 34.35,76.49 v34.36,76.47 | v49.21,72.13 49.27,72.07 49.27,70.86 48.25,69.84 ADC2.3
  Bottom 0.152: U$18.P$1 36.45,75.02 34.53,75.02 34.45,75.1 R70.1
CS_GYRO  (via drill 0.35)
  Top 0.2: IC1.9 31.58,21.81 32.64,21.81 33.35,22.52 v33.35,23.07 v33.36,23.07
  Bottom 0.152: R51.2 28.81,24.13 29.49,24.13 31.7,26.34 32.44,26.34
  Bottom 0.2: 32.4,26.34 32.44,26.34 32.87,26.34 32.87,23.56 v33.36,23.07 | R51.2 28.37,20.64 30.61,18.4 30.61,13.16 32.23,11.54 41.96,11.54 42.57,12.14 48.9,12.14 49.75,12.99 49.75,19 51.14,20.39 52.83,20.39 53.48,19.75 53.48,17.35 53.9,16.93 60.53,16.93 61.4,17.79 61.4,25.89 60.51,26.78 59.81,26.78 U$4.CS
FAULT_X
  Top 0.2: X_DRV.6 34.27,17.53 33.51,18.29 IC1.2
FAULT_Y
  Top 0.2: X_DRV1.6 16.65,12.96 17.33,12.28 19.84,12.28 21.24,13.68 21.24,14.69 21.23,14.7 21.23,16.17 21.24,16.19 21.24,16.88 23.15,18.79 IC1.3
FAULT_Z  (via drill 0.35)
  Top 0.2: IC1.4 33.06,19.29 v33.12,19.35 v33.13,19.34 | X_DRV2.6 27.07,32.72 v26.72,33.06 v26.72,33.07
  Route15 0.2: v26.72,33.07 32.05,33.07 33.35,31.76 33.35,27.57 32.26,26.48 32.26,21.15 32.29,21.15 33.13,20.31 v33.13,19.34
FLASH1_CS  (via drill 0.35)
  Top 0.2: IC1.52 23.21,14.57 24.67,13.11 28.03,13.11 v29.13,14.21
  Route15 0.2: v29.13,14.21 29.16,14.24 29.16,17.26 21.02,25.4 21.02,28.32 | v40.62,36.32 22.11,36.32 21.02,35.22 21.02,28.32 | v20.09,28.31 21.01,28.31 21.02,28.32
  Bottom 0.2: v40.62,36.32 40.65,36.32 40.65,36.59 38.79,38.45 35.33,38.45 34.88,38.89 FLASH_SENSOR.1 | R54.1 20.05,28.33 20.06,28.34 v20.09,28.31
FLASH2_CS  (via drill 0.3, 0.35)
  Top 0.2: IC1.53 23.71,14.6 24.84,13.46
  Top 0.203: 24.84,13.46 27.26,13.46 v27.99,14.19 v27.99,14.2
  Route15 0.2: v18.82,38.65 18.82,38.63 17.31,38.63 16.45,37.76 16.45,27.39 27.99,15.85 v27.99,14.2
  Bottom 0.152: FLASH_CAM.1 19.77,37.7 18.09,36.03 R57.1
  Bottom 0.2: v18.82,38.65 19.77,37.71 19.77,37.7
GND  (via drill 0.3, 0.35)
  Top 0.15: U$7.12 43.05,33.41
  Top 0.152: 18,70.76 U$9.3 | 30.05,68.06 ADC3.14 | C61.2 24.48,32.98 | 24.48,32.98 25.38,32.98 25.4,32.96 | v24.25,35.6 24.25,33.21 24.48,32.98 | C62.2 36.81,12.95 37.19,13.32 37.19,15.36 37.37,15.54 37.37,19.31 37.69,19.63 37.61,19.71 X_DRV.11 | IC1.12 30.3,23.29 v30.1,23.49
  Top 0.2: IC1.31 22.23,27.66 | v29.75,26.27 29.31,26.71 28.92,26.71 28.71,26.92 IC1.18 | IC1.60 27.21,16.68 27.45,16.92 28.32,16.92 28.71,16.53 IC1.63 | IC1.47 20.08,18.29 v21.55,19.76
  Top 0.203: v22.48,25.95 22.48,26.65 22.23,26.9 22.23,27.66 IC1.31
  Top 0.254: U$9.3 17.73,70.76
  Top 0.406: U$12.10 47.95,62.55 48.28,62.23 48.28,59.9 | 48.28,59.9 48.28,58.88 48.83,58.33 51.74,58.33 51.94,58.53 51.94,60.12 | U$12.5 52.22,62.55 51.94,62.28 51.94,60.12 | 30.02,61.74 ADC3.9 30.1,61.67 | 12.8,70.74 13.05,71 13.05,73.25 | 12.78,70.76 U$9.12 | 18,70.76 17.98,70.74 17.17,70.74 16.76,71.15 16.76,73.1 16.78,73.11 | C20.2 9.51,62.2 C19.2 13.78,62.2 C25.2 17.29,62.19 C27.2 | 37.06,68.11 V_REF2.3 | 16.78,73.11 16.78,74.53 16.12,75.2 13.67,75.2 13.05,74.58 13.05,73.25 | U$9.10 11.89,73.25 13.05,73.25 | 16.78,73.11 16.96,73.3 U$9.5 | U$12.12 48.16,60.01 48.28,59.9 | U$12.3 52.05,60.01 51.94,60.12 | U$11.3 50.13,78.63 | 50.1,81.14 U$11.5 50.03,81.07 | U$8.3 30.7,81.22 | U$5.5 | 30.19,68.12 ADC3.14 | X_DRV.11 35.37,20.12 35.37,20.16
  Bottom 0.127: R71.1 22.13,75.37 22.24,75.37 23,74.61 U$15.P$4 | U1.3 U1.11 52.07,37.56 U1.9 | R85.1 50.18,53.3 51.37,53.3 52.38,54.32 R88.2
  Bottom 0.152: 35.42,21.12 C60.2
  Bottom 0.2: C50.2 11.24,46 11.37,46.13 C52.2 11.37,51.51 C53.2 11.32,51.67 | U1.9 52.07,36.16 52.07,35.97 54.1,33.94 C57.2 | C38.2 57.24,53.47 58.7,52.01 58.7,51.39 58.89,51.2 59.51,51.2 U$14.2
  Bottom 0.203: U2.7 43.61,20.52 U2.11 44.61,21.52 U2.2
  other vias: 51.14,15.62 25.38,50.1 30.94,50.6 52.64,35.31 51.01,40.69 20.48,80.68 21.96,78.16 25.84,78.77 32.45,77.31 50.58,46.44 33.23,81.68 49.42,64.76 12.09,60.13 55.62,75.89 5.1,30 6.49,34.73 12.85,30.58 18.29,33.64 28.54,75.48 50.35,61.1 14.48,13.36 33.91,26.39 17.7,65.45 22,62.27 9.6,46.78 10.16,54.43 51.99,58.48 46.17,23.04 53.41,55.58 48.18,83.6 57.83,54.76 60.76,52.26 18.8,49.63 40.63,38.18 23.12,17.61
  pour Top: 0,88 64,88 64,0 0,0
  pour Bottom: 9,88 64,88 64,0 0,0 0,88
  pour Route2: 0,88 64,88 64,0 0,0
  pour Route15: 0,88 64,88 64,0 0,0
GND_SOLAR  (via drill 0.35)
  Top 0.406: U$21.P$3 18.28,79.66 v18.22,79.6
  Route2 0.406: v1.86,24.57 1.86,62.62 7.09,67.85 7.09,82.37 7.57,82.85 v7.58,82.85
  Bottom 0.406: U$1.P$58 U$1.P$57 49.15,6.79 48.82,6.47 9.92,6.47 6.76,9.63 6.76,14.75 2.03,19.48 1.86,19.48 1.85,19.5 1.85,24.57 v1.86,24.57 | v7.58,82.85 15.25,82.85 17.09,81.02 17.09,78.28 17.35,78.02 17.91,78.02 18.22,78.33 18.22,79.56 18.2,79.58 v18.22,79.6
I2C1_SCL  (via drill 0.35)
  Top 0.2: IC1.58 26.21,14.59 25.86,14.25 v25.23,14.25
  Route15 0.2: U$3.5 8.93,25.27 16.32,17.88 16.36,17.92 21.82,17.92 24.08,15.66 24.08,14.53 24.35,14.26 v25.23,14.26 v25.23,14.25
I2C1_SDA  (via drill 0.35)
  Top 0.2: IC1.59 26.72,15.43 26.69,15.39 26.69,14.7 26.68,14.7 v26.68,14.14
  Route2 0.2: U$3.6 11.47,21.78 9.94,20.25 9.94,15.29 12.68,12.55 17.74,12.55 19.26,14.08 24.22,14.08 24.77,13.53 26.07,13.53 v26.68,14.14
MD_VOL_DEF  (via drill 0.35)
  Top 0.2: v18,14.7 17.91,14.61 X_DRV1.7 | v28.14,30.59 28.49,30.94 X_DRV2.7
  Route2 0.2: v28.14,30.59 28.1,30.55 19.48,30.55 14.79,25.85 14.79,19.75 16.51,18.03 18.39,18.03 19.47,16.95 19.47,15.41 18.76,14.7 v18,14.7
MD_VOL_REF  (via drill 0.35)
  Top 0.2: v37.51,26.42 37.39,26.42 35.22,28.59 27.95,28.59 27.93,28.57 27.92,28.57 27.71,28.35 IC1.20 | v35.24,15.71 35.24,16.68 35.25,16.69 35.25,17.5 X_DRV.7
  Route2 0.2: v37.51,26.42 38.03,25.89 38.03,17.1 36.38,15.45 35.54,15.45 35.29,15.71 v35.24,15.71
N$1
  Top 0.15: R8.1 42.91,53.42 | 48.73,51.48 U$6.7 48.74,51.41 50.61,51.41 R6.1
  Top 0.2: C4.2 46.92,53.42 | 48.74,51.41 47.83,51.41 47.03,52.21 47.03,53.31 46.92,53.42 | 42.91,53.42 46.92,53.42
N$2  (via drill 0.35)
  Top 0.15: R15.2 42.68,43.66 U$6.14
  Top 0.2: U$6.14 41.44,43.79 41.01,44.22 v41,44.22 v40.99,44.21
  Bottom 0.2: ADC1.1 34.9,46.13 34.9,46.1 35.84,45.16 40.04,45.16 v40.99,44.21
N$3  (via drill 0.35)
  Top 0.15: R16.1 40.86,53.8 | 40.85,53.81 41.81,53.81 42.6,53.03 42.56,52.98 U$6.8
  Top 0.152: v40.88,52.56 40.88,53.78 40.86,53.8 40.85,53.81
  Bottom 0.2: ADC1.2 31.66,47.13 32.03,47.51 34.62,47.51 35.3,47.51 37.2,45.62 37.21,45.63 39.53,45.63 40.88,46.98 v40.88,52.56
N$4  (via drill 0.35)
  Top 0.15: 5.01,55.4 6.22,55.4 10.61,55.4 11.05,54.95 11.05,53.94 | 11.05,53.94 11.05,52.49 11.02,52.45 | 11.05,53.94 11.61,53.94 v11.63,53.97
  Top 0.152: 6.22,55.4 7.03,56.2 7.03,57.75 7.21,57.93 7.34,57.93 R14.1
  Top 0.2: U$5.8 11.02,52.45
  Bottom 0.15: v11.63,53.97 13.01,53.97 17.02,49.96 17.02,44.94 18.41,43.54 25.4,43.54 26.58,44.73 26.57,44.73 26.57,45.86
  Bottom 0.406: ADC1.6 26.57,45.86
N$5
  Top 0.15: R8.2 37.14,55.39 R16.2 36.28,55.51 35.85,55.07 35.85,52.39 36.4,51.84 40.01,51.84 41.71,50.14 U$6.9
N$6  (via drill 0.35)
  Top 0.15: R35.2 33.25,54.58 33.79,54.04 U$10.14
  Top 0.2: R35.2 31.62,54.63 31.62,55.58 31.06,56.14 28.52,56.14 28.48,56.1 v28.41,56.1
  Bottom 0.2: ADC1.7 25.3,44.95 24.8,44.45 23.63,44.45 23.17,44.91 23.17,54.04 25.23,56.1 v28.41,56.1
N$7  (via drill 0.35)
  Top 0.15: R36.1 35.38,44.81 34.93,45.27 33.8,45.27 U$10.8
  Top 0.2: v37.47,46.54 37.47,45.44 36.85,44.81 R36.1
  Bottom 0.15: v37.47,46.54 37.51,46.57 37.51,47.16 36.76,47.9 24.6,47.9 24.04,47.34 ADC1.8
N$8  (via drill 0.35)
  Top 0.127: R13.2 11,43
  Top 0.15: 11,43 U$5.14 | R13.2 9.7,42.89 9.48,42.66 9.48,40.05 9.81,39.72 12.95,39.72 13.41,40.18 14.75,40.18 15.51,39.43
  Top 0.152: 15.51,39.43 20.43,39.43 20.73,39.73 20.73,42.04 20.71,42.06 20.71,42.38 v21.16,42.83
  Bottom 0.152: ADC1.5 27.84,45.05 26.01,43.22 21.56,43.22 v21.16,42.83
N$9  (via drill 0.3, 0.35)
  Top 0.127: R23.2 38.63,83.82
  Top 0.15: 38.63,83.82 U$8.14 | 24.39,71.77 25.71,71.77 26.88,72.94 35.79,72.94 38.08,75.24 39.94,75.24 40.98,76.28 40.98,78.62 v41,78.64
  Top 0.152: ADC3.1 23.94,71.33 24.39,71.77
  Top 0.2: v40.95,80.84 40.95,82.84 39.91,83.88 38.69,83.88 38.63,83.82
  Bottom 0.2: v40.95,80.84 41,80.89 v41,78.64
N$10
  Top 0.15: R2.1 18.75,52.44 U$5.7 13.16,52.44 12.77,52.82 12.77,55.42
  Top 0.152: C2.2 13.37,56.82 | 13.37,56.82 13.37,56.02 12.77,55.42 | R4.1 10.91,58.6 12.77,56.75 13.3,56.75 13.37,56.82
N$11
  Top 0.152: 8.12,56.05 8.08,56.09 R14.2 | R4.2 10.63,56.58 11.46,55.75
  Top 0.2: 8.12,56.05 8.42,55.75 11.46,55.75 12.34,54.87 12.34,52.29 11.8,51.75 11.43,51.75 11,51.31 U$5.9
N$12
  Top 0.15: R20.1 27.54,79.53 24.62,79.53 C8.2
  Top 0.152: R22.1 32.83,74.73 32.83,75.58 32.21,76.2 U$8.7 30.61,76.16 26.81,76.16 26.66,76.31 26.66,78.04 R20.1
N$13
  Top 0.15: R3.1 R1.1 | U$5.1 17.56,44.35 R1.1 | R1.1 17.58,42.94 C1.1
N$14
  Top 0.15: U$5.13 12,46.09 13.21,44.88 R3.2 13.19,42.95 13.19,41.67 12.71,41.19 R13.1
N$15
  Bottom 0.2: C33.1 53.93,27.14 52.86,28.2 47.66,28.2 46.04,26.59 46.04,25.15 46.05,25.14 45.51,24.59 45.51,22.1 U2.1
N$16
  Top 0.2: R5.1 54.41,43.2 54.35,43.26 52.27,43.26 C3.1 48.75,43.23 48.66,43.14 | U$6.1 48.66,43.14 | 48.66,43.14 48.66,42.42 R7.1
N$17
  Top 0.15: U$6.13 43.41,45.06 44.41,44.06 44.41,42.3 R15.1
  Top 0.2: R15.1 46.7,42.28 R7.2
N$21
  Top 0.15: 59.47,44.95 R10.1
  Top 0.2: C6.2 59.47,47.09 59.47,44.95 R12.1 59.47,41.88 59.02,41.44 50.57,41.44 48.99,39.86 U$7.7
N$22
  Top 0.15: 46.99,39.68 46.99,38.71 46.45,38.17 45.11,38.17 44.16,37.22 U$7.9
  Top 0.2: R18.2 46.99,39.68 47.91,39.68 47.91,40.18 48.64,40.9 49.49,40.9 50.5,41.91 50.51,41.91 55.49,41.91 56.45,42.87 R12.2
  Top 0.406: R18.2 46.99,39.68
N$23
  Top 0.2: U$7.1 51.23,30.87 54.04,33.67 R11.1 54.57,34.39 55.08,34.89 56.04,34.89 56.29,35.15 C5.1 56.3,36.03 R9.1
N$24
  Top 0.152: U$7.13 43.09,32.14 44.01,31.22 44.01,30.45 44.38,30.07 54.37,30.07 54.55,30.25 54.55,31.25 R17.1
  Top 0.2: R17.1 54.51,32.22 54.79,32.5 55.89,32.5 56.27,32.89 R11.2
N$25  (via drill 0.3, 0.35)
  Top 0.406: v30.96,59.58 30.96,59.45 31.93,58.48 43.77,58.48 44.24,58.94 v44.24,59.25
  Bottom 0.406: R61.1 40.89,58.09 43.5,58.09 44.14,57.45 U$23.P$5 46.2,57.45 46.66,57.92 46.66,58.63 46.44,58.85 44.64,58.85 v44.24,59.25 | v30.96,59.58 30.98,59.58 30.98,65.58 29.84,66.71 27.97,66.71 26.96,67.73 U$22.1
N$27  (via drill 0.35)
  Top 0.2: v4.52,44.31 4.39,44.18 C23.1 | v4.54,52.08 4.55,52.1 5.84,52.1 V_REF1.2 9.64,52.19 9.65,52.21 v9.75,52.21
  Route2 0.2: v4.52,44.31 4.09,44.31 3.69,44.71 3.69,51.04 4.54,51.88 v4.54,52.08
  Route15 0.2: v34.32,56.42 33.87,56.42 32.49,57.79 23.14,57.79 17.64,52.3 9.85,52.3 v9.75,52.21
  Bottom 0.2: ADC1.15 31.66,53.77 34.3,56.42 v34.32,56.42
N$28  (via drill 0.35)
  Top 0.15: v40.65,39.78 v40.66,39.77 43.01,39.77 | R18.1 43.01,39.77 | U$7.8 42.9,39.66 43.01,39.77
  Bottom 0.2: ADC1.4 29.11,44.62 29.56,44.18 37.8,44.18 38.11,43.87 38.1,43.87 40.65,41.32 v40.65,39.78
N$29
  Top 0.15: C12.2 25.43,45.01 R32.1 27.3,44.96 27.61,45.26 U$10.7 29.27,45.26 29.87,44.67 R34.1
N$30  (via drill 0.35)
  Top 0.152: 42.9,30.76 42.9,30.24 43.34,29.79 55.69,29.79 56.27,30.38 56.27,31.23 R17.2
  Top 0.2: 42.9,30.76 U$7.14 41.2,30.87 40.5,31.57 v40.46,31.57
  Bottom 0.2: ADC1.3 30.39,44.91 30.78,44.51 37.99,44.51 41.43,41.07 41.43,32.43 41.34,32.43 40.48,31.57 v40.46,31.57
N$31
  Top 0.127: U$8.9 37.63,77.47 38.55,78.39
  Top 0.15: 36.22,77.46 36.69,77.46 36.71,77.44
  Top 0.152: R22.2 34.49,75.73 36.22,77.46
  Top 0.2: 36.71,77.44 U$8.9
  Top 0.254: 38.55,78.39 R24.2
N$32
  Top 0.15: 26.86,84.98 C7.1
  Top 0.2: R21.1 32.91,84.55 32.16,83.8 30.66,83.8 U$8.1 29.2,83.82 28.04,84.98 26.86,84.98 | R19.1 26.89,84.92 C7.1
N$33
  Top 0.127: R21.2 34.73,84.91
  Top 0.15: 38.76,82.55 U$8.13 36.24,82.55 34.73,84.06 34.73,84.91
  Top 0.152: 38.76,82.55 R23.1
N$36
  Top 0.127: R26.1 22.39,76.02
  Top 0.152: U$9.7 19.98,75.84 C10.2 22.39,76.02 | R26.1 24.61,76.03 R28.1
N$37
  Top 0.15: 25.49,77.47 13.6,77.47 R30.2 13.55,75.94 12.78,75.16 12.44,75.16 U$9.9
  Top 0.152: 25.49,77.47 25.92,77.04 25.92,74.69 25.5,74.27 R28.2
N$38
  Top 0.152: R27.1 15.99,67.51 16.68,68.19 17.92,68.19 U$9.1 18.98,67.18 R25.1
  Top 0.2: R25.1 18.98,64.63 C9.1
N$39
  Top 0.152: R29.1 12.03,66.33 | 12.03,66.33 13.07,66.33 13.04,66.36 13.04,69.12 12.67,69.49 12.06,69.49 | R27.2 12.04,66.35 12.03,66.33
  Top 0.406: U$9.13 12.06,69.49
N$40
  Bottom 0.2: U2.10 41.2,22.02 | 41.2,22.02 R83.1 | C55.1 41.24,22.06 41.2,22.02
N$41
  Bottom 0.2: C34.1 54.09,24.55 53.18,25.45 50.38,25.45 49.66,24.74 R77.2 47.15,24.74 46.83,24.42 46.83,21.86 46.83,21.28 46.57,21.02 U2.3 45.99,21.02
N$42  (via drill 0.35)
  Top 0.152: U$9.14 11.75,68.12 10.67,68.12 10.1,67.55 R29.2 8.8,66.33 v8.01,67.12 | ADC3.3 v22.36,68.03 v22.35,68.03
  Bottom 0.152: v22.35,68.03 8.92,68.03 v8.01,67.12
N$43
  Top 0.15: 11.86,77.44 U$9.8
  Top 0.2: R30.1 11.86,78.56 12.16,78.86 22.39,78.86 23.4,77.85 25.62,77.85 26.25,77.22 26.25,73.44 25.5,72.69 22.65,72.69 22.64,72.71 21.7,71.77 21.7,67.14 22.05,66.79 23.91,66.79 ADC3.4
  Top 0.406: R30.1 11.86,77.44
N$44
  Bottom 0.406: R61.2 41.01,54.8 41.68,54.8 41.71,54.83 43.29,54.83 43.53,55.07 43.53,55.83 43.85,56.15 U$23.P$7 48.18,56.15 R62.2
N$45
  Top 0.152: R24.1 38.26,76.2 U$8.8 36.74,74.38 35.67,73.31 26.85,73.31 25.69,72.14 22.75,72.14 22.27,71.67 22.27,69.88 22.86,69.3 ADC3.2
N$46
  Top 0.15: R34.2 32.63,44.86 32.63,46.08 33.08,46.53 U$10.9 35.95,46.53 R36.2
N$47
  Top 0.15: R31.1 23.76,57.73 C11.1 23.82,57.66 24.73,57.66 24.89,57.51 24.89,56.16 25.07,55.98 25.08,55.99 R33.1 26.04,53.35 26.54,52.85 27.66,52.85 U$10.1
N$48
  Top 0.15: U$10.13 33.14,51.61 31.89,52.86 30.46,52.86 29.96,53.36 R35.1
  Top 0.2: R35.1 27.92,54.58 27.39,55.12 27.39,57.29 26.98,57.69 R33.2
N$52  (via drill 0.3)
  Top 0.127: ADC3.15 32.46,69.3 32.47,69.3
  Top 0.15: C27.1 17.64,63.87 19.3,62.21 20.76,62.21 23.02,59.95 27.66,59.95 27.72,59.89 30.84,56.77 v30.87,56.77 | 32.47,69.3 v32.5,69.3 34.67,67.14 V_REF2.2
  Bottom 0.15: v30.87,56.77 31.23,56.77 31.57,57.11 31.57,67.16 32.54,68.13 32.54,69.26 v32.5,69.3
N$53  (via drill 0.3, 0.35)
  Top 0.15: U$11.14 44.08,74.22 R41.2 44.03,72.46 v43.81,72.23
  Top 0.152: ADC3.5 25.34,65.49 26.1,66.25 26.1,69.75 28.63,72.28 v40.36,72.28
  Bottom 0.15: v43.81,72.23 40.41,72.23 v40.36,72.28
N$54  (via drill 0.35)
  Top 0.15: 27.04,69.96 28.73,71.66 40.83,71.66 | 25.18,64.22 ADC3.6
  Top 0.152: 25.18,64.22 27.04,66.08 27.04,69.96 | v41.67,77.36 41.67,72.5 40.83,71.66 | R42.1 44.17,83.85 U$11.8
  Top 0.2: U$11.8 43,83.76 42.67,83.43 v42.67,81.27
  Bottom 0.152: v41.67,77.36 41.67,77.71 41.75,77.79 41.75,80.34 v42.67,81.27
N$55
  Top 0.127: C14.2 52.7,83.36 R38.1
  Top 0.15: 50.08,83.87 U$11.7
  Top 0.152: R40.1 50.08,83.87 | C14.2 52.45,83.31 51.99,83.76 U$11.7
N$56
  Top 0.15: U$11.9 44.63,83.04 44.92,83.04 45.88,84
  Top 0.152: 45.88,84 R42.2 48.28,85.28 R40.2
N$57
  Top 0.15: U$11.1 50.18,74.55 R39.1 49.84,72.82 50.28,72.38 50.29,72.39 52.22,72.39 C13.1 52.19,73.8 R37.1
N$58
  Top 0.15: R41.1 45.79,74.17 | 45.79,74.17 48.11,74.17 R39.2 | U$11.13 44.95,77.41 45.75,76.61 45.75,74.21 45.79,74.17
N$60  (via drill 0.35)
  Top 0.2: ADC4.15 46.42,23.62 46.09,23.95 46.09,27.25 44.81,28.53 40.39,28.53 37.77,31.15 37.77,31.48 37.82,31.54 v37.84,31.54
  Route15 0.2: v37.84,31.54 37.84,32.28 41.33,35.77 41.33,36.89 41.02,37.2 22.39,37.2 19.33,34.14 19.35,34.12 v19.35,27.52
  Bottom 0.2: V_REF3.2 8.69,30.39 8.95,30.12 10.27,30.12 10.28,30.13 10.49,30.13 10.96,29.66 C48.1 10.96,27.19 12.19,25.95 18.72,25.95 19.38,26.61 19.38,27.51 19.37,27.52 v19.35,27.52
N$61
  Top 0.127: R46.1 50.2,68.82 C16.2 52.95,68.82
  Top 0.15: R44.1 57.05,64.3 57.06,64.31 56.28,65.09 U$12.7 53.18,68.6 52.95,68.82
N$62
  Top 0.15: R48.2 48.49,67.14 | 48.49,67.14 49.26,67.14 R46.2 | 48.49,67.14 48.49,64.18 48.13,63.81 48.12,63.82 U$12.9
N$63
  Top 0.15: R43.1 57.44,56.5 C15.1 55.06,56.71 53.2,56.71 | R45.1 51.58,56.49 51.8,56.71 53.2,56.71 | U$12.1 53.18,56.73 53.2,56.71
N$64
  Top 0.15: R47.1 45.48,56.34 49.17,56.34 R45.2 49.19,56.32 48.58,56.32 48.6,56.34 48.6,57.59 47.45,58.74 U$12.13
N$65
  Bottom 0.2: U2.9 41.82,21.52 40.63,20.33 R83.2 39.39,17.91 R78.1
N$66  (via drill 0.35)
  Route2 0.2: v43.76,13.93 43.76,27.9 43.75,27.91 43.8,27.91 v43.84,27.87
  Bottom 0.2: U$26.2 47.16,35.66 44.12,35.66 43.15,34.69 43.15,31.38 | 43.15,31.38 43.16,31.39 CR1.1 | U2.6 42.71,14.89 43.71,13.88 43.76,13.88 v43.76,13.93 | 43.15,31.38 43.15,28.56 v43.84,27.87
N$67
  Top 0.15: 22.72,62.95 22.61,62.84 22.61,61.19 23.43,60.37 27.63,60.37 28,60 | 30.07,57.93 30.53,57.47 43.32,57.47 | R47.2 43.32,57.47 | 43.32,57.47 U$12.14
  Top 0.152: 28,60 30.07,57.93
  Top 0.2: 22.72,62.95 ADC3.7
N$68  (via drill 0.3)
  Top 0.15: R48.1 45.92,68.84 45.68,68.61 45.68,65.1 | 45.68,65.1 45.68,62.99 v45.88,62.79 | U$12.8 45.69,65.09 45.68,65.1 | v45.1,59.66 v45.09,59.66 45.09,58.42 44.7,58.03 30.38,58.03 26.74,61.68 ADC3.8
  Bottom 0.15: v45.1,59.66 45.88,60.44 v45.88,62.79
N$69  (via drill 0.35)
  Top 0.152: v29.24,77.1 27.88,77.1 v27.29,77.69
  Bottom 0.152: U$16.8 U$16.7 34.47,79.78 33.84,80.41 27.61,80.41 27.21,80.81 24.37,80.81 24.08,80.53 24.08,78.32 23.65,77.89 U$15.P$6 23.65,76.19 24.17,75.68 25.67,75.68 27.29,77.3 v27.29,77.69 | R74.1 43.29,79.61 42.95,79.27 42.95,76.29 42.64,75.98 R65.1 40.17,77.35 40.17,77.52 39.99,77.7 38.47,77.7 37.55,76.78 37.55,74.73 36.75,73.93 31.66,73.93 31.15,74.44 31.15,76.78 30.95,76.98 29.36,76.98 v29.24,77.1
N$70
  Bottom 0.2: R53.1 24.71,42.35 25.28,42.92 26.21,42.92 27.15,43.85 37.08,43.85 37.42,43.51 FLASH_SENSOR.3
N$71
  Bottom 0.2: FLASH_CAM.7 22.13,30.84 22.65,30.32 22.66,30.33 26.48,30.33 26.7,30.11 R55.1
N$72
  Bottom 0.152: Q3.1 26.72,79.78 | U$15.P$7 24.3,77.84 24.55,78.08 26.19,78.08 26.68,78.57 26.68,79.74 26.72,79.78 | 30.87,79.78 26.72,79.78
  Bottom 0.406: U$16.2 30.87,79.78
N$73
  Bottom 0.2: FLASH_CAM.3 23.4,37.46 23.12,37.17 20.22,37.17 18.97,35.93 18.97,32.53 17.4,30.96 16.89,30.96 R56.1
N$74
  Bottom 0.2: R52.1 33.82,36.17 35.05,34.95 35.81,34.95 36.16,34.6 FLASH_SENSOR.7
N$75